# Altium schematic sheet 12_Clock_2.SchDoc: Clock 2
size A3; Organization: Lime Microsystems; Address1: Surrey Tech Centre; Address2: Guildford GU2 7YG; Address3: Surrey; Address4: United Kingdom; SheetNumber: 12
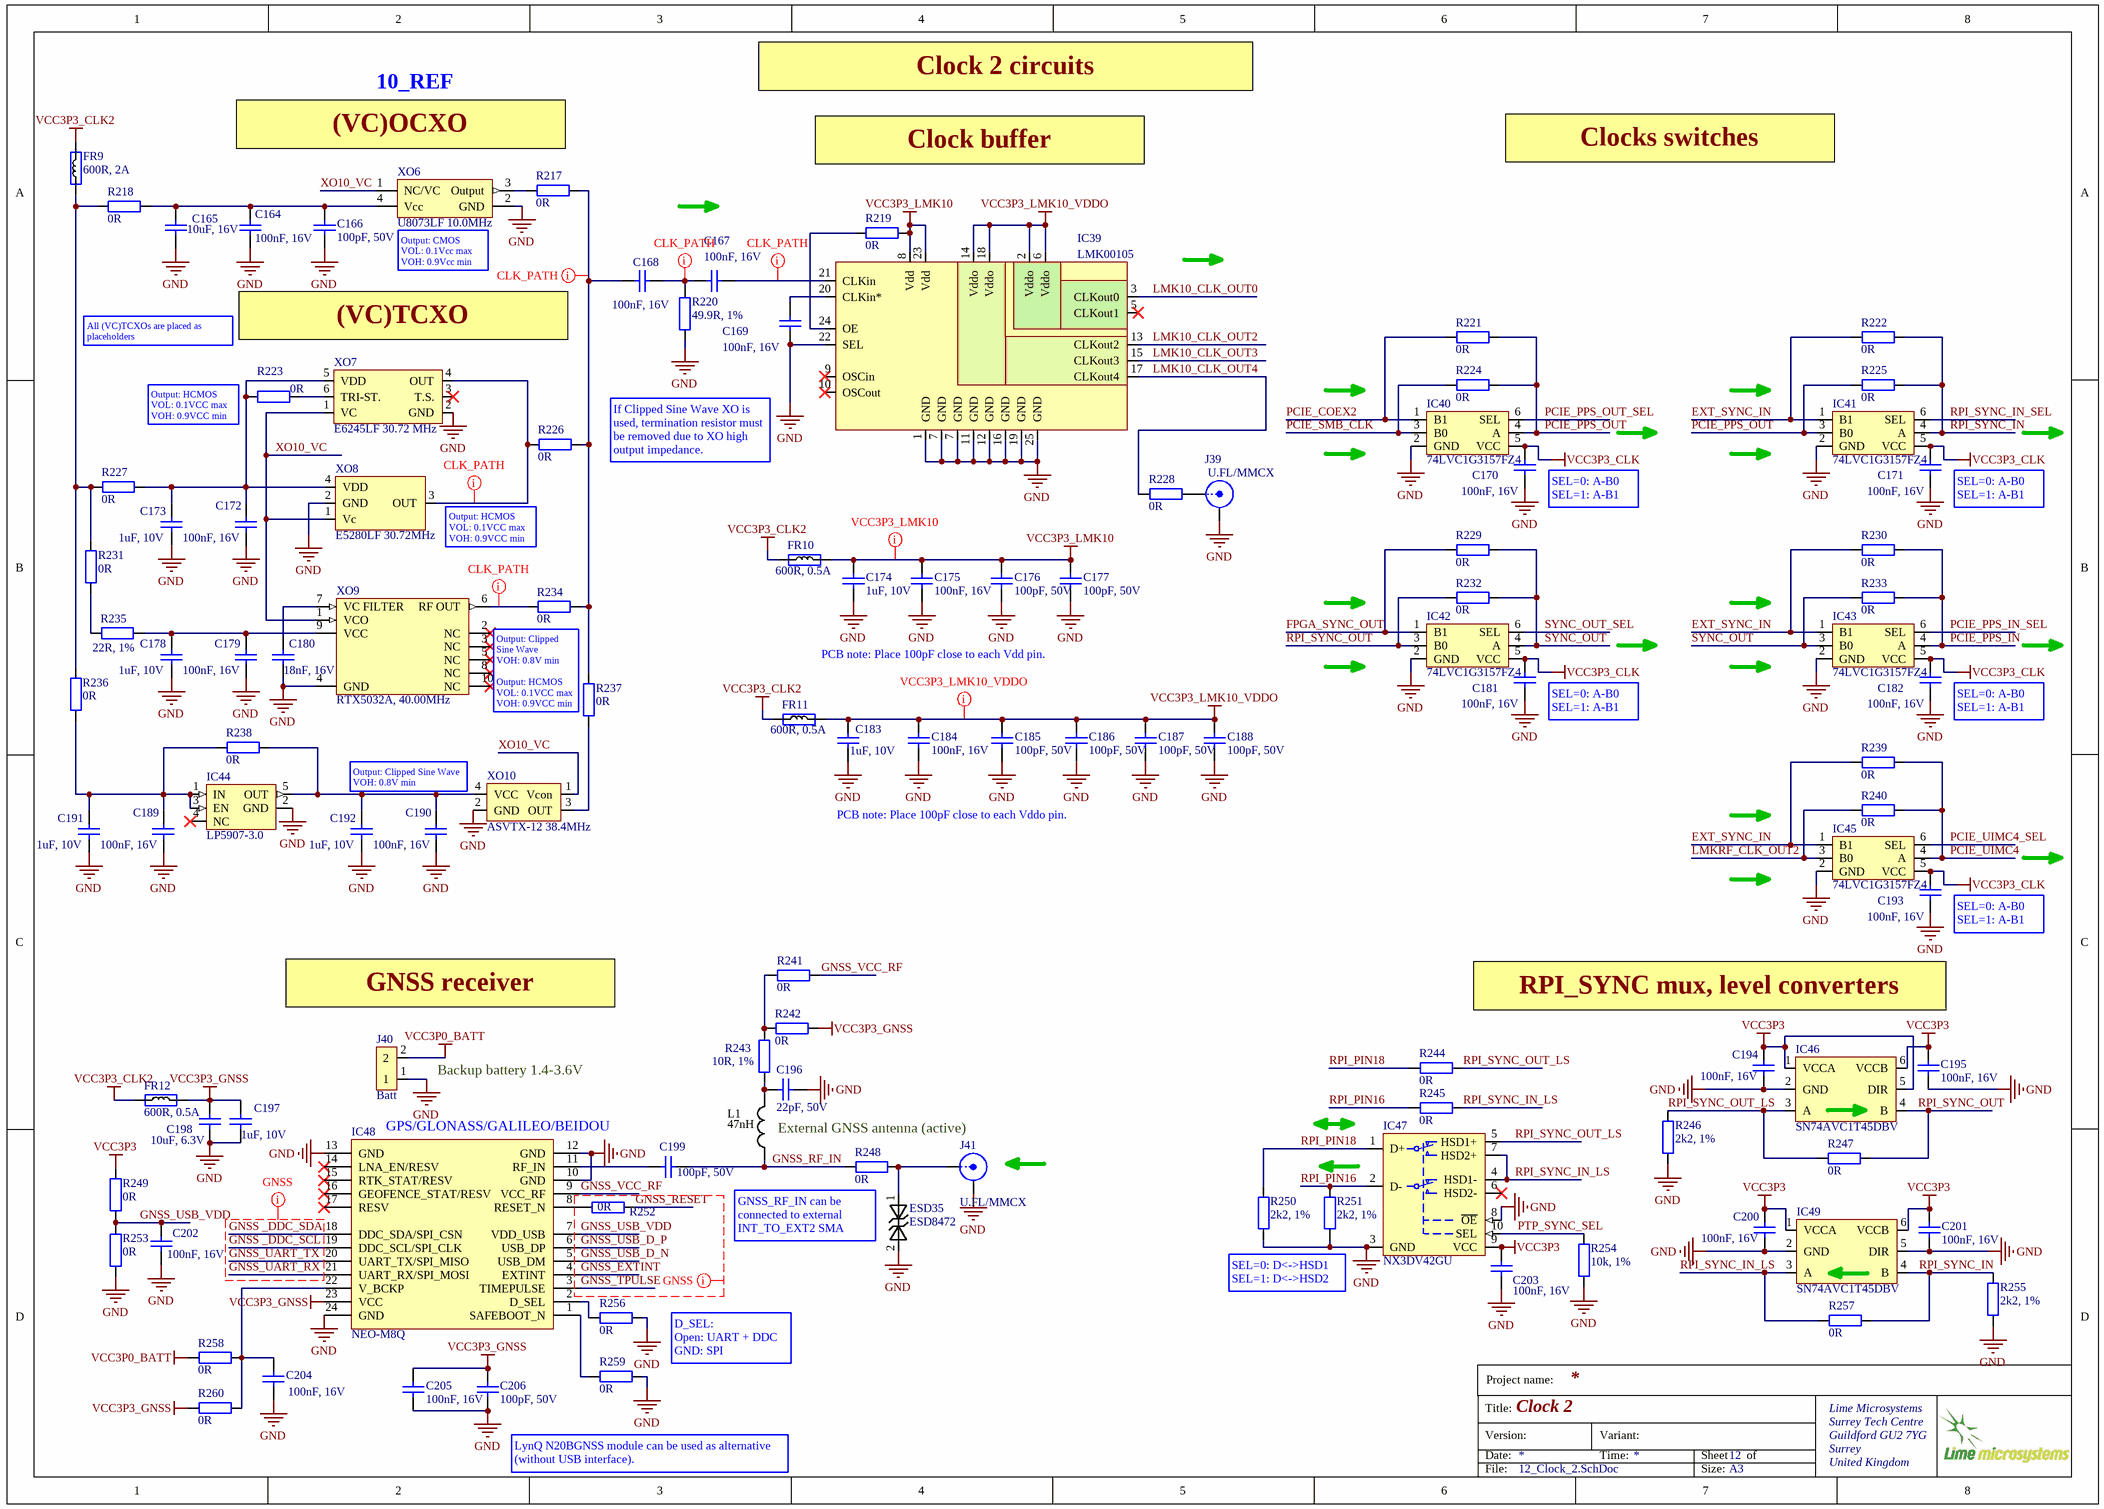
[diagram p0: 12_Clock_2.SchDoc]

## Parts
C164  100nF, 16V  [CAP0402]
C165  10uF, 16V  [CAP0603]
C166  100pF, 50V  [CAP0402]
C167  100nF, 16V  [CAP0402]
C168  100nF, 16V  [CAP0402]
C169  100nF, 16V  [CAP0402]
C170  100nF, 16V  [CAP0402]
C171  100nF, 16V  [CAP0402]
C172  100nF, 16V  [CAP0402]
C173  1uF, 10V  [CAP0402]
C174  1uF, 10V  [CAP0402]
C175  100nF, 16V  [CAP0402]
C176  100pF, 50V  [CAP0402]
C177  100pF, 50V  [CAP0402]
C178  1uF, 10V  [CAP0402]
C179  100nF, 16V  [CAP0402]
C180  18nF, 16V  [CAP0402]
C181  100nF, 16V  [CAP0402]
C182  100nF, 16V  [CAP0402]
C183  1uF, 10V  [CAP0402]
C184  100nF, 16V  [CAP0402]
C185  100pF, 50V  [CAP0402]
C186  100pF, 50V  [CAP0402]
C187  100pF, 50V  [CAP0402]
C188  100pF, 50V  [CAP0402]
C189  100nF, 16V  [CAP0402]
C190  100nF, 16V  [CAP0402]
C191  1uF, 10V  [CAP0402]
C192  1uF, 10V  [CAP0402]
C193  100nF, 16V  [CAP0402]
C194  100nF, 16V  [CAP0402]
C195  100nF, 16V  [CAP0402]
C196  22pF, 50V  [CAP0402]
C197  1uF, 10V  [CAP0402]
C198  10uF, 6.3V  [CAP0603]
C199  100pF, 50V  [CAP0402]
C200  100nF, 16V  [CAP0402]
C201  100nF, 16V  [CAP0402]
C202  100nF, 16V  [CAP0402]
C203  100nF, 16V  [CAP0402]
C204  100nF, 16V  [CAP0402]
C205  100nF, 16V  [CAP0402]
C206  100pF, 50V  [CAP0402]
ESD35  ESD8472  [ESD8472_X3DFN2]
FR9  600R, 2A  [RES0805]
FR10  600R, 0.5A  [RES0402]
FR11  600R, 0.5A  [RES0402]
FR12  600R, 0.5A  [RES0402]
IC39  LMK00105  [LMK00105SQ]
IC40  74LVC1G3157FZ4  [74LVC1G3157FZ4_SPDT_SW_DFN1410-6]
IC41  74LVC1G3157FZ4  [74LVC1G3157FZ4_SPDT_SW_DFN1410-6]
IC42  74LVC1G3157FZ4  [74LVC1G3157FZ4_SPDT_SW_DFN1410-6]
IC43  74LVC1G3157FZ4  [74LVC1G3157FZ4_SPDT_SW_DFN1410-6]
IC44  LP5907-3.0  [SOT23-5]
IC45  74LVC1G3157FZ4  [74LVC1G3157FZ4_SPDT_SW_DFN1410-6]
IC46  SN74AVC1T45DBV  [SOT23-6]
IC47  NX3DV42GU  [FSUSB42UMX]
IC48  NEO-M8Q  [NEO-7M/8M]
IC49  SN74AVC1T45DBV  [SOT23-6]
J39  U.FL/MMCX  [MMCX_UFL_conn_u]
J40  Batt  [HDR_1x2]
J41  U.FL/MMCX  [MMCX_UFL_conn_u]
L1  47nH  [RES0402]
R217  0R  [RES0402_v2]
R218  0R  [RES0402]
R219  0R  [RES0402]
R220  49.9R, 1%  [RES0402]
R221  0R  [RES0402_v2]
R222  0R  [RES0402_v2]
R223  0R  [RES0402]
R224  0R  [RES0402_v2]
R225  0R  [RES0402_v2]
R226  0R  [RES0402_v2]
R227  0R  [RES0402]
R228  0R  [RES0402]
R229  0R  [RES0402_v2]
R230  0R  [RES0402_v2]
R231  0R  [RES0402]
R232  0R  [RES0402_v2]
R233  0R  [RES0402_v2]
R234  0R  [RES0402_v2]
R235  22R, 1%  [RES0402]
R236  0R  [RES0402]
R237  0R  [RES0402_v2]
R238  0R  [RES0402]
R239  0R  [RES0402_v2]
R240  0R  [RES0402_v2]
R241  0R  [RES0402]
R242  0R  [RES0402]
R243  10R, 1%  [RES0402]
R244  0R  [RES0402]
R245  0R  [RES0402]
R246  2k2, 1%  [RES0402]
R247  0R  [RES0402]
R248  0R  [RES0402_v2]
R249  0R  [RES0402]
R250  2k2, 1%  [RES0402]
R251  2k2, 1%  [RES0402]
R252  0R  [RES0402]
R253  0R  [RES0402]
R254  10k, 1%  [RES0402]
R255  2k2, 1%  [RES0402]
R256  0R  [RES0402]
R257  0R  [RES0402]
R258  0R  [RES0402]
R259  0R  [RES0402]
R260  0R  [RES0402]
XO6  U8073LF 10.0MHz  [AOCJYR-10.000MHz]
XO7  E6245LF 30.72 MHz  [RAKON_RPT7050A]
XO8  E5280LF 30.72MHz  [RAKON_TXCO]
XO9  RTX5032A, 40.00MHz  [RAKON_RTX5032A]
XO10  ASVTX-12 38.4MHz  [CRYSTAL_4-LCC_2P5x2P0]

## Nets
GND: C164.1 C165.1 C166.2 C169.1 C170.1 C171.1 C172.1 C173.1 C174.1 C175.1 C176.1 C177.1 C178.1 C179.1 C180.1 C181.1 C182.1 C183.1 C184.1 C185.1 C186.1 C187.1 C188.1 C189.1 C190.1 C191.1 C192.1 C193.1 C194.2 C195.2 C196.1 C197.1 C198.1 C200.2 C201.2 C202.2 C203.2 C204.2 C205.1 C206.2 ESD35.2 IC39.1(GND) IC39.7(GND) IC39.11(GND) IC39.12(GND) IC39.16(GND) IC39.19(GND) IC39.22(SEL) IC39.25(GND) IC40.2(GND) IC41.2(GND) IC42.2(GND) IC43.2(GND) IC44.2(GND) IC45.2(GND) IC46.2(GND) IC47.3(GND) IC47.8(~{OE}) IC48.10(GND) IC48.12(GND) IC48.13(GND) IC48.24(GND) IC49.2(GND) IC49.5(DIR) J39.2(Y) J40.1 J41.2(Y) R220.1 R246.2 R250.2 R251.2 R253.1 R254.2 R255.2 R256.1 R259.1 XO6.2(GND) XO7.2(GND) XO8.2(GND) XO9.4(GND) XO10.2(GND)
VCC3P0_BATT: J40.2 R258.2
VCC3P3: C194.1 C195.1 C200.1 C201.1 C203.1 IC46.1(VCCA) IC46.5(DIR) IC46.6(VCCB) IC47.9(VCC) IC49.1(VCCA) IC49.6(VCCB) R249.1
VCC3P3_CLK: C170.2 C171.2 C181.2 C182.2 C193.2 IC40.5(VCC) IC41.5(VCC) IC42.5(VCC) IC43.5(VCC) IC45.5(VCC)
VCC3P3_CLK2: FR9.1 FR10.1 FR11.1 FR12.1
VCC3P3_GNSS: C197.2 C198.2 C205.2 C206.1 FR12.2 IC48.23(VCC) R242.1 R260.2
VCC3P3_LMK10: C174.2 C175.2 C176.2 C177.2 FR10.2 IC39.8(Vdd) IC39.23(Vdd) R219.2
VCC3P3_LMK10_VDDO: C183.2 C184.2 C185.2 C186.2 C187.2 C188.2 FR11.2 IC39.2(Vddo) IC39.6(Vddo) IC39.14(Vddo) IC39.18(Vddo)
EXT_SYNC_IN: IC41.1(B1) IC43.1(B1) IC45.1(B1) R222.2 R230.2 R239.2
FPGA_SYNC_OUT: IC42.1(B1) R229.2
GNSS _DDC_SCL: IC48.19(DDC_SCL/SPI_CLK)
GNSS _DDC_SDA: IC48.18(DDC_SDA/SPI_CSN)
GNSS_EXTINT: IC48.4(EXTINT)
GNSS_RESET: R252.1
GNSS_RF_IN: C199.1 L1.1 R248.2
GNSS_TPULSE: IC48.3(TIMEPULSE)
GNSS_UART_RX: IC48.21(UART_RX/SPI_MOSI)
GNSS_UART_TX: IC48.20(UART_TX/SPI_MISO)
GNSS_USB_D_N: IC48.5(USB_DM)
GNSS_USB_D_P: IC48.6(USB_DP)
GNSS_USB_VDD: C202.1 IC48.7(VDD_USB) R249.2 R253.2
GNSS_VCC_RF: IC48.9(VCC_RF) R241.2
LMK10_CLK_OUT0: IC39.3(CLKout0)
LMK10_CLK_OUT2: IC39.13(CLKout2)
LMK10_CLK_OUT3: IC39.15(CLKout3)
LMK10_CLK_OUT4: IC39.17(CLKout4) R228.2
LMKRF_CLK_OUT2: IC45.3(B0) R240.2
PCIE_COEX2: IC40.1(B1) R221.2
PCIE_PPS_IN: IC43.4(A) R230.1 R233.1
PCIE_PPS_IN_SEL: IC43.6(SEL)
PCIE_PPS_OUT: IC40.4(A) IC41.3(B0) R221.1 R224.1 R225.2
PCIE_PPS_OUT_SEL: IC40.6(SEL)
PCIE_SMB_CLK: IC40.3(B0) R224.2
PCIE_UIMC4: IC45.4(A) R239.1 R240.1
PCIE_UIMC4_SEL: IC45.6(SEL)
PTP_SYNC_SEL: IC47.10(SEL) R254.1
RPI_PIN16: IC47.2(D-) R245.2 R251.1
RPI_PIN18: IC47.1(D+) R244.2 R250.1
RPI_SYNC_IN: IC41.4(A) IC49.4(B) R222.1 R225.1 R255.1 R257.1
RPI_SYNC_IN_LS: IC47.4(HSD1-) IC47.7(HSD2+) IC49.3(A) R245.1 R257.2
RPI_SYNC_IN_SEL: IC41.6(SEL)
RPI_SYNC_OUT: IC42.3(B0) IC46.4(B) R232.2 R247.1
RPI_SYNC_OUT_LS: IC46.3(A) IC47.5(HSD1+) R244.1 R246.1 R247.2
SYNC_OUT: IC42.4(A) IC43.3(B0) R229.1 R232.1 R233.2
SYNC_OUT_SEL: IC42.6(SEL)
XO10_VC: XO6.1(NC/VC) XO7.1(VC) XO8.1(Vc) XO9.1(VCO) XO10.1(Vcon)
NetC164_2: C164.2 C165.2 C166.1 R218.2 XO6.4(Vcc)
NetC167_1: C167.1 IC39.21(CLKin)
NetC167_2: C167.2 C168.1 R220.2
NetC168_2: C168.2 R217.1 R226.1 R234.2 R237.1
NetC169_2: C169.2 IC39.20(CLKin*)
NetC172_2: C172.2 C173.2 R223.2 R227.1 XO7.5(VDD) XO8.4(VDD)
NetC178_2: C178.2 C179.2 R235.2 XO9.9(VCC)
NetC180_2: C180.2 XO9.7(VC_FILTER)
NetC189_2: C189.2 C191.2 IC44.1(IN) IC44.3(EN) R236.2 R238.2
NetC190_2: C190.2 C192.2 IC44.5(OUT) R238.1 XO10.4(VCC)
NetC196_2: C196.2 L1.2 R243.1
NetC199_2: C199.2 IC48.11(RF_IN)
NetC204_1: C204.1 IC48.22(V_BCKP) R258.1 R260.1
NetESD35_1: ESD35.1 J41.1(X) R248.1
NetFR9_2: FR9.2 R218.1 R227.2 R231.1 R236.1
NetIC39_24: IC39.24(OE) R219.1
NetIC48_1: IC48.1(SAFEBOOT_N) R259.2
NetIC48_2: IC48.2(D_SEL) R256.2
NetIC48_8: IC48.8(RESET_N) R252.2
NetJ39_1: J39.1(X) R228.1
NetR217_2: R217.2 XO6.3(Output)
NetR223_1: R223.1 XO7.6(TRI-ST.)
NetR226_2: R226.2 XO7.4(OUT) XO8.3(OUT)
NetR231_2: R231.2 R235.1
NetR234_1: R234.1 XO9.6(RF_OUT)
NetR237_2: R237.2 XO10.3(OUT)
NetR241_1: R241.1 R242.2 R243.2

Not connected (* = marked no-connect by the designer): IC39 5(CLKout1)* 9(OSCin)* 10(OSCout)*; IC44 4(NC)*; IC47 6(HSD2-)*; IC48 14(LNA_EN/RESV)* 15(RTK_STAT/RESV)* 16(GEOFENCE_STAT/RESV)* 17(RESV)*; XO7 3(T.S.)*; XO9 2(NC)* 3(NC)* 5(NC)* 8(NC)* 10(NC)*

## Layout directives
net class CLK_PATH: NetC167_1, NetC167_2, NetC168_2, NetR226_2, NetR234_1
net class VCC3P3_LMK10: VCC3P3_LMK10
net class VCC3P3_LMK10_VDDO: VCC3P3_LMK10_VDDO
net class GNSS: GNSS _DDC_SCL, GNSS _DDC_SDA, GNSS_EXTINT, GNSS_RESET, GNSS_TPULSE, GNSS_UART_RX, GNSS_UART_TX, GNSS_USB_D_N, GNSS_USB_D_P, GNSS_USB_VDD

## Notes on the sheet
- 10_REF
- Clock 2 circuits
- (VC)OCXO
- Clock buffer
- Clocks switches
- (near XO6) Output: CMOS
  VOL: 0.1Vcc max
  VOH: 0.9Vcc min
- All (VC)TCXOs are placed as placeholders
- (VC)TCXO
- (near R223) Output: HCMOS
  VOL: 0.1VCC max
  VOH: 0.9VCC min
- (near R226) If Clipped Sine Wave XO is used, termination resistor must be removed due to XO high output impedance.
- (near C170) SEL=0: A-B0
  SEL=1: A-B1
- (near C171) SEL=0: A-B0
  SEL=1: A-B1
- (near XO8) Output: HCMOS
  VOL: 0.1VCC max
  VOH: 0.9VCC min
- (near R237) Output: Clipped Sine Wave
  VOH: 0.8V min
  Output: HCMOS
  VOL: 0.1VCC max
  VOH: 0.9VCC min
- PCB note: Place 100pF close to each Vdd pin.
- (near C181) SEL=0: A-B0
  SEL=1: A-B1
- (near C182) SEL=0: A-B0
  SEL=1: A-B1
- Output: Clipped Sine Wave
  VOH: 0.8V min
- PCB note: Place 100pF close to each Vddo pin.
- (near C193) SEL=0: A-B0
  SEL=1: A-B1
- (near J40) GNSS receiver
- RPI_SYNC mux, level converters
- (near J40) Backup battery 1.4-3.6V
- (near IC48) GPS/GLONASS/GALILEO/BEIDOU
- (near L1) External GNSS antenna (active)
- GNSS_RF_IN can be connected to external INT_TO_EXT2 SMA connector.
- SEL=0: D<->HSD1
  SEL=1: D<->HSD2
- D_SEL:
  Open: UART + DDC
  GND: SPI
- LynQ N20BGNSS module can be used as alternative  (without USB interface).
- Project name:
- Title:
- Version:
- Date:
- Variant:
- Time:
- Sheet
- of
- File:
- Size:
- A3

## Library data of the parts
C164 C167-C172 C175 C179 C181 C182 C184 C193-C195 C200 C201 C203 = Cap_0402: Manufacturer: Murata Electronics; Manufacturer Part Number: GRM155R71C104KA88D; Part Description: 0.10µF ±10% 16V Ceramic Capacitor X7R 0402 (1005 Metric); Tolerance: 10 %; Type: General Purpose MLCC; Capacitance: 0.1 uF; Case Length: 1 mm; Dielectric: X7R; Case Height: 0.5 mm; Temperature Coefficient / Code: +/- 15 %; Value: 100nF, 16V; Supplier 1: Mouser; Supplier Part Number 1: 81-GRM155R71C104KA88; Case Code - in: 0402; RoHS: RoHS Compliant; Operating Temperature Range: - 55 C to + 125 C; Series: GRM; Termination Style: SMD/SMT; Package / Case: 0402 (1005 metric); Voltage Rating DC: 16 V; Maximum Operating Temperature: + 125 C; Case Code - mm: 1005; Minimum Operating Temperature: - 55 C; Product Category: Low & Medium Capacitance SMD Ceramic Chip Capacitors; Packaging: Reel; Product: General Type MLCCs; Category: Multilayer Ceramic Capacitors MLCC - SMD/SMT; Brand: Murata Electronics; Case Width: 0.5 mm; RoHS - Mouser: Y; Standard Pack Qty: 10000; Minimum Order Quantity: 1; Reeling: True; Manufacturer Part Number 1: GRM155R71C104KA88D
C165 = Cap_0603: Manufacturer: Yageo; Manufacturer Part Number 1: GRM188R61C106MA73D; Part Description: 10µF ±20% 16V Ceramic Capacitor X5R 0603 (1608 Metric); Temperature Coefficient: X5R; Capacitance: 10µF; Tolerance: ±20%; Value: 10uF, 16V; Supplier 1: Digi-Key; Supplier Part Number 1: 490-7201-2-ND; Category: Capacitors; Ratings: -; Features: -; Lead Style: -; Package / Case: 0603 (1608 Metric); Lead Spacing: -; Applications: General Purpose; Voltage - Rated: 16V; Operating Temperature: -55°C ~ 85°C; Thickness (Max): 0.039" (1.00mm); Mounting Type: Surface Mount, MLCC; RoHS: RoHS Compliant; Size / Dimension: 0.063" L x 0.031" W (1.60mm x 0.80mm); Packaging: Tape & Reel (TR); Height - Seated (Max): -
C166 C199 C206 = Cap_0402: Manufacturer Part Number 1: CC0402JRNPO9BN101; Manufacturer: Yageo; Part Description: 100pF ±5% 50V C0G, NP0 Ceramic Capacitor -55°C ~ 125°C Surface Mount, MLCC 0402 (1005 Metric) 0.039" L x 0.020" W (1.00mm x 0.50mm); Tolerance: ±5%; Temperature Coefficient: C0G, NP0; Value: 100pF, 50V; Capacitance: 100pF; Thickness (Max): 0.022" (0.55mm); Size / Dimension: 0.039" L x 0.020" W (1.00mm x 0.50mm); RoHS: RoHS Compliant; Ratings: -; Package / Case: 0402 (1005 Metric); Mounting Type: Surface Mount, MLCC; Height - Seated (Max): -; Features: -; Lead Spacing: -; Voltage - Rated: 50V; Operating Temperature: -55°C ~ 125°C; Packaging: Cut Tape (CT); Applications: General Purpose; Lead Style: -; Supplier 1: Digi-Key; Category: Capacitors; Supplier Part Number 1: 311-1024-1-ND
C173 C178 = Cap_0402: CAP CER 1UF 10V X5R 0402; Manufacturer: Yageo; Part Description: 1µF 10V Ceramic Capacitor X5R 0402 (1005 Metric) 0.039" L x 0.020" W (1.00mm x 0.50mm); Manufacturer Part Number 1: CC0402MRX5R6BB105; Voltage Rating: 10; Capacitance: 1; Capacitance Tolerance: ± 10%; Ceramic Capacitor Case: 0402 [1005 Metric]; Dielectric Characteristic: X6; Product Range: TDK - C Series; Value: 1uF, 10V; Supplier 1: Digi-Key; Supplier Part Number 1: 311-1732-1-ND; RoHS: YES; MSL: -
C174 C183 C197 = Cap_0402: CAP CER 1UF 10V X5R 0402; Manufacturer: Yageo; Part Description: 1µF 10V Ceramic Capacitor X5R 0402 (1005 Metric) 0.039" L x 0.020" W (1.00mm x 0.50mm); Manufacturer Part Number 1: CC0402MRX5R6BB105; Notification: Current market demand for these product types have resulted in fluctuating and extending lead times. Lead times may differ.; Tolerance: ±20%; Value: 1uF, 10V; Supplier 1: Digi-Key; Supplier Part Number 1: 311-1732-1-ND; RoHS: RoHS Compliant; Applications: General Purpose; Category: Capacitors; ComponentLink1Description: http://www.yageo.com/documents/recent/UPY-GPHC_X5R_4V-to-50V_25.pdf; ComponentLink1URL: http://www.yageo.com/documents/recent/UPY-GPHC_X5R_4V-to-50V_25.pdf; Failure Rate: -; Features: -; Height - Seated (Max): -; Lead Spacing: -; Lead Style: -; Mounting Type: Surface Mount, MLCC; Operating Temperature: -55°C ~ 85°C; Package / Case: 0402 (1005 Metric); Packaging: Cut Tape (CT); Part Status: Active; Pricing 1: 1=0.22, 10=0.156, 100=0.0732, 500=0.0513, 1000=0.04248, 2500=0.03953, 5000=0.03617 (USD); Ratings: -; Size / Dimension: 0.039" L x 0.020" W (1.00mm x 0.50mm); Stock 1: 69600; Temperature Coefficient: X5R; Thickness (Max): 0.022" (0.55mm); Voltage - Rated: 10V
C176 C177 C185-C188 = Cap_0402: Manufacturer Part Number 1: CC0402JRNPO9BN101; Manufacturer: Yageo; Part Description: 100pF ±5% 50V C0G, NP0 Ceramic Capacitor -55°C ~ 125°C Surface Mount, MLCC 0402 (1005 Metric) 0.039" L x 0.020" W (1.00mm x 0.50mm); Temperature Coefficient: C0G, NP0; Tolerance: ±5%; Value: 100pF, 50V; Supplier 1: Digi-Key; Supplier Part Number 1: 311-1024-1-ND; RoHS: RoHS Compliant; Category: Capacitors; Applications: General Purpose; Mounting Type: Surface Mount, MLCC; Capacitance: 100pF; Ratings: -; Packaging: Cut Tape (CT); Voltage - Rated: 50V; Size / Dimension: 0.039" L x 0.020" W (1.00mm x 0.50mm); Height - Seated (Max): -; Package / Case: 0402 (1005 Metric); Operating Temperature: -55°C ~ 125°C; Features: -; Lead Spacing: -; Lead Style: -; Thickness (Max): 0.022" (0.55mm)
C180 = Cap_0402: Manufacturer: Yageo; Manufacturer Part Number 1: CC0402KRX7R7BB183; Part Description: 0.018µF ±10% 16V Ceramic Capacitor X7R 0402 (1005 Metric); Temperature Coefficient: X7R; Capacitance: 0.018µF; Tolerance: ±10%; Value: 18nF, 16V; Supplier 1: Digi-Key; Supplier Part Number 1: 311-1706-1-ND; Part Status: Active; Category: Capacitors; Packaging: Cut Tape (CT); Voltage - Rated: 16V; RoHS: RoHS Compliant; Size / Dimension: 0.039" L x 0.020" W (1.00mm x 0.50mm); Package / Case: 0402 (1005 Metric); Mounting Type: Surface Mount, MLCC; Thickness (Max): 0.022" (0.55mm); Applications: General Purpose; Operating Temperature: -55°C ~ 125°C
C189 C190 = Cap_0402: Manufacturer: Murata Electronics; Manufacturer Part Number 1: GRM155R71C104KA88D; Part Description: 0.10µF ±10% 16V Ceramic Capacitor X7R 0402 (1005 Metric); Tolerance: 10 %; Type: General Purpose MLCC; Capacitance: 0.1 uF; Case Length: 1 mm; Dielectric: X7R; Case Height: 0.5 mm; Temperature Coefficient / Code: +/- 15 %; Value: 100nF, 16V; Supplier 1: Mouser; Supplier Part Number 1: 81-GRM155R71C104KA88; Case Code - in: 0402; RoHS: RoHS Compliant; Operating Temperature Range: - 55 C to + 125 C; Series: GRM; Termination Style: SMD/SMT; Package / Case: 0402 (1005 metric); Voltage Rating DC: 16 V; Maximum Operating Temperature: + 125 C; Case Code - mm: 1005; Minimum Operating Temperature: - 55 C; Product Category: Low & Medium Capacitance SMD Ceramic Chip Capacitors; Packaging: Reel; Product: General Type MLCCs; Category: Multilayer Ceramic Capacitors MLCC - SMD/SMT; Brand: Murata Electronics; Case Width: 0.5 mm; RoHS - Mouser: Y; Standard Pack Qty: 10000; Minimum Order Quantity: 1; Reeling: True; Manufacturer Part Number: GRM155R71C104KA88D
C191 C192 = Cap_0402: Manufacturer Part Number 1: CC0402MRX5R6BB105; Manufacturer: Yageo; Part Description: 1µF 10V Ceramic Capacitor X5R 0402 (1005 Metric) 0.039" L x 0.020" W (1.00mm x 0.50mm); Voltage Rating: 10; Capacitance Tolerance: ± 10%; Product Range: TDK - C Series; Ceramic Capacitor Case: 0402 [1005 Metric]; Capacitance: 1; Dielectric Characteristic: X6; Value: 1uF, 10V; Supplier 1: Digi-Key; Supplier Part Number 1: 311-1732-1-ND; MSL: -; RoHS: YES
C196 = Cap_0402: Manufacturer: Yageo; Manufacturer Part Number 1: CC0402JRNPO9BN220; Part Description: 22pF ±5% 50V C0G, NP0 Ceramic Capacitor -55°C ~ 125°C Surface Mount, MLCC 0402 (1005 Metric) 0.039" L x 0.020" W (1.00mm x 0.50mm); Tolerance: ±5%; Temperature Coefficient: C0G, NP0; Value: 22pF, 50V; Supplier 1: Digi-Key; Supplier Part Number 1: 311-1018-2-ND; Category: Capacitors; Voltage - Rated: 50V; Packaging: Tape & Reel (TR); RoHS: RoHS Compliant; Capacitance: 22pF; Operating Temperature: -55°C ~ 125°C; Mounting Type: Surface Mount, MLCC; Height - Seated (Max): -; Size / Dimension: 0.039" L x 0.020" W (1.00mm x 0.50mm); Ratings: -; Applications: General Purpose; Thickness (Max): 0.022" (0.55mm); Lead Spacing: -; Lead Style: -; Features: -; Package / Case: 0402 (1005 Metric)
C198 = Cap_0603: Manufacturer Part Number 1: CC0603MRX5R5BB106; Manufacturer: Yageo; Part Description: 10µF ±20% 6.3V X5R Ceramic Capacitor -55°C ~ 85°C Surface Mount, MLCC 0603 (1608 Metric) 0.063" L x 0.031" W (1.60mm x 0.80mm); Capacitance: 10µF; Tolerance: ±20%; Supplier 1: Digi-Key; Supplier Part Number 1: 311-1448-2-ND; Package / Case: 0603 (1608 Metric); Category: Capacitors; Voltage - Rated: 6.3V; Value: 10uF, 6.3V
C202 C204 = Cap_0603: Manufacturer Part Number 1: GRM155R71C104KA88D; Part Description: 0.10µF ±10% 16V X7R Ceramic Capacitor -55°C ~ 125°C Surface Mount, MLCC 0402 (1005 Metric) 0.039" L x 0.020" W (1.00mm x 0.50mm); Brand: Murata Electronics; Tolerance: 10 %; Type: General Purpose MLCC; Capacitance: 0.1 uF; Temperature Coefficient / Code: +/- 15 %; Case Height: 0.5 mm; Case Length: 1 mm; Dielectric: X7R; Supplier 1: Mouser; Supplier Part Number 1: 81-GRM155R71C104KA88; Case Code - in: 0402; Manufacturer: Murata Electronics; Category: Multilayer Ceramic Capacitors MLCC - SMD/SMT; Voltage Rating DC: 16 V; Value: 100nF, 16V; Manufacturer Part Number: GRM155R71C104KA88D; Case Code - mm: 1005; Case Width: 0.5 mm; Maximum Operating Temperature: + 125 C; Minimum Operating Temperature: - 55 C; Minimum Order Quantity: 1; Operating Temperature Range: - 55 C to + 125 C; Package / Case: 0402 (1005 metric); Packaging: Reel; Product: General Type MLCCs; Product Category: Low & Medium Capacitance SMD Ceramic Chip Capacitors; Reeling: True; RoHS - Mouser: Y; RoHS: RoHS Compliant; Series: GRM; Standard Pack Qty: 10000; Termination Style: SMD/SMT
C205 = Cap_0402: Manufacturer: Murata Electronics; Manufacturer Part Number: GRM155R71C104KA88D; Part Description: 0.10µF ±10% 16V X7R Ceramic Capacitor -55°C ~ 125°C Surface Mount, MLCC 0402 (1005 Metric) 0.039" L x 0.020" W (1.00mm x 0.50mm); Tolerance: 10 %; Type: General Purpose MLCC; Capacitance: 0.1 uF; Case Length: 1 mm; Dielectric: X7R; Case Height: 0.5 mm; Temperature Coefficient / Code: +/- 15 %; Value: 100nF, 16V; Supplier 1: Mouser; Supplier Part Number 1: 81-GRM155R71C104KA88; Case Code - in: 0402; RoHS: RoHS Compliant; Operating Temperature Range: - 55 C to + 125 C; Series: GRM; Termination Style: SMD/SMT; Package / Case: 0402 (1005 metric); Voltage Rating DC: 16 V; Maximum Operating Temperature: + 125 C; Case Code - mm: 1005; Minimum Operating Temperature: - 55 C; Product Category: Low & Medium Capacitance SMD Ceramic Chip Capacitors; Packaging: Reel; Product: General Type MLCCs; Category: Multilayer Ceramic Capacitors MLCC - SMD/SMT; Brand: Murata Electronics; Case Width: 0.5 mm; RoHS - Mouser: Y; Standard Pack Qty: 10000; Minimum Order Quantity: 1; Reeling: True; Manufacturer Part Number 1: GRM155R71C104KA88D
ESD35 = ESD8472: Manufacturer: ON Semiconductor; Manufacturer Part Number: ESD8472MUT5G; Part Description: TVS DIODE 5.3VWM 14VC X3DFN2; Voltage - Reverse Standoff (Typ): 5.3V (Max); Voltage - Breakdown (Min): 7V; Voltage - Clamping (Max) @ Ipp: 14V; Current - Peak Pulse (10/1000µs): 3A (8/20µs); Power Line Protection: No; Capacitance @ Frequency: 0.2pF @ 1MHz; Supplier 1: Digi-Key; RoHS: RoHS Compliant; Category: Circuit Protection; Stock 1: 2295; Pricing 1: 1=0.39, 10=0.315, 100=0.2142, 500=0.16068, 1000=0.12051 (USD); Packaging: Cut Tape (CT); Part Status: Active; Type: Zener; Power - Peak Pulse: -; Applications: Automotive, RF Antenna; Operating Temperature: -55°C ~ 150°C (TJ); Mounting Type: Surface Mount; Package / Case: 2-XFDFN; Supplier Device Package: 2-X3DFN (0.62x0.32); ComponentLink1URL: http://www.onsemi.com/pub/Collateral/ESD8472-D.PDF; ComponentLink1Description: http://www.onsemi.com/pub/Collateral/ESD8472-D.PDF; Supplier Part Number 1: ESD8472MUT5GOSCT-ND; Manufacturer Part Number 1: ESD8472MUT5G
FR9 = Ferrite: Manufacturer Part Number 1: MPZ2012S601AT000; Manufacturer: TDK Corporation; Part Description: FERRITE BEAD 600 OHM 0805 1LN; DC Resistance (DCR): 100 mOhm Max; Filter Type: Differential Mode - Single; Impedance @ Frequency: 600 Ohm @ 100MHz; Supplier 1: Digi-Key; Supplier Part Number 1: 445-2206-2-ND; Value: 600R, 2A; Category: Filters; Current Rating: 2A; Height (Max): 0.041" (1.05mm); Mounting Type: Surface Mount; Package / Case: 0805 (2012 Metric); Packaging: Tape & Reel (TR); RoHS: RoHS Compliant; Size / Dimension: 0.079" L x 0.049" W (2.00mm x 1.25mm)
FR10-FR12 = Ferrite: Manufacturer: Murata; Manufacturer Part Number 1: BLM15AX601SN1D; Part Description: - Ferrite Bead 0402 (1005 Metric) 500mA 340mOhm; Tolerance: 25%; Current Rating: 500mA; Number of Lines: 1; DC Resistance (DCR): 340mR; Test Frequency: 100MHz; Value: 600R, 0.5A; Supplier 1: Digi-Key; Supplier Part Number 1: 490-5441-1-ND; Stock 1: 416370; Pricing 1: 1=0.1, 10=0.06, 25=0.0552, 50=0.0496, 100=0.0363, 250=0.0264, 500=0.0242, 1000=0.0209, 5000=0.0165 (USD); Case/Package: 0402; Number of Pins: 2; Case Code (Metric): 1005; Case Code (Imperial): 0402; Core Material: Ferrite; Material: Steel,Ferrite; Min Operating Temperature: -55°C; Max Operating Temperature: 125°C; Package Quantity: 1; Packaging: Tape and Reel; Series: BLM15AX_SN; Impedance: 600R; Max Current Rating: 500mA; Termination: SMD/SMT; Max DC Current: 500mA; Number of Circuits: 1; DC Resistance-Max: 340mR; Length: 1mm; Width: 0.5mm; Height: 0.5mm; Depth: 0.5mm; REACH SVHC: No SVHC; Lead Free: Lead Free; RoHS Compliant: Yes; ComponentLink1URL: https://www.murata.com/en-us/products/productdata/8796740059166/ENFA0018.pdf?src-supplier=Digi-Key; ComponentLink1Description: https://www.murata.com/en-us/products/productdata/8796740059166/ENFA0018.pdf?src-supplier=Digi-Key; ComponentLink2URL: http://search.murata.co.jp/Ceramy/image/img/PDF/ENG/L0110S0100BLM15AX_SN.pdf?src-supplier=Future+Electronics; ComponentLink2Description: http://search.murata.co.jp/Ceramy/image/img/PDF/ENG/L0110S0100BLM15AX_SN.pdf?src-supplier=Future+Electronics; ComponentLink3URL: http://www.produktinfo.conrad.com/datenblaetter/1100000-1199999/001171675-da-01-en-CHIP_DROSSEL0402_600R_420MA_1_0X0_5MM.pdf?src-supplier=Conrad; ComponentLink3Description: http://www.produktinfo.conrad.com/datenblaetter/1100000-1199999/001171675-da-01-en-CHIP_DROSSEL0402_600R_420MA_1_0X0_5MM.pdf?src-supplier=Conrad; ComponentLink4URL: http://www.produktinfo.conrad.com/datenblaetter/1100000-1199999/001172169-da-01-en-DROSSEL_0402_600R_1_0X0_5MM_10000ST.pdf?src-supplier=Conrad; ComponentLink4Description: http://www.produktinfo.conrad.com/datenblaetter/1100000-1199999/001172169-da-01-en-DROSSEL_0402_600R_1_0X0_5MM_10000ST.pdf?src-supplier=Conrad
IC39 = LMK00105: Manufacturer: Texas Instruments; Manufacturer Part Number 1: LMK00105SQ/NOPB; Part Description: IC CLK BUFFER 2:5 200MHZ 24WQFN; Frequency - Max: 200MHz; Voltage - Supply: 2.375 V ~ 3.45 V; Input: HCSL, LVCMOS, LVDS, LVPECL, LVTTL, SSTL, Crystal; Differential - Input:Output: Yes/No; Supplier 1: Digi-Key; Type: Fanout Buffer (Distribution), Multiplexer, Translator; Category: Integrated Circuits (ICs); Operating Temperature: -40°C ~ 85°C; Package / Case: 24-WFQFN Exposed Pad; Supplier Device Package: 24-WQFN (4x4); Supplier Part Number 1: LMK00105SQ/NOPBCT-ND
IC40-IC43 IC45 = 74LVC1G3157FZ4_SPDT_SW: Part Description: 1 Circuit IC Switch 2:1 10Ohm X2-DFN1410-6; Manufacturer: Diodes; Manufacturer Part Number 1: 74LVC1G3157FZ4-7; Number of Circuits: 1; On-State Resistance: 10R; -3db Bandwidth: 300MHz; Supplier 1: Digi-Key; Supplier Part Number 1: 74LVC1G3157FZ4-7DICT-ND; Stock 1: 158709; Pricing 1: 1=0,42000, 10=0,31200, 25=0,27320, 100=0,17670, 250=0,14628, 500=0,11702, 1000=0,08972, 2500=0,07802 (USD); RoHS: Yes; Number of Pins: 6; Min Operating Temperature: -40°C; Max Operating Temperature: 125°C; Packaging: Tape and Reel; RoHS Compliant: Yes; ComponentLink1URL: https://www.diodes.com/assets/Datasheets/74LVC1G3157.pdf?src-supplier=Digi-Key; ComponentLink1Description: https://www.diodes.com/assets/Datasheets/74LVC1G3157.pdf?src-supplier=Digi-Key; ComponentLink2URL: https://www.diodes.com/assets/product-showcases/74LVC3157-NPA-0516.pdf?src-supplier=Digi-Key; ComponentLink2Description: https://www.diodes.com/assets/product-showcases/74LVC3157-NPA-0516.pdf?src-supplier=Digi-Key
IC44 = LP5907: Manufacturer: Texas Instruments; Manufacturer Part Number 1: LP5907QMFX-3.0Q1; Part Description: Linear Voltage Regulator IC Positive Fixed 1 Output  250mA SOT-23-5; Number of Outputs: 1; Min Input Voltage: 2.2V; Max Input Voltage: 5.5V; Max Output Current: 250mA; Output Voltage: 3V; Dropout Voltage: 50mV; Polarity: Positive; Quiescent Current: 425uA; Accuracy: 2%; Output Type: Fixed; Supplier 1: Digi-Key; Stock 1: 90911; Pricing 1: 1 = 0,65000, 10 = 0,56000, 100 = 0,41820, 500 = 0,32858, 1000 = 0,25390 (USD); RoHS: Yes; Mount: Surface Mount; Case/Package: SOT-23-5; Min Operating Temperature: -40°C; Max Operating Temperature: 125°C; Packaging: Tape and Reel; Output Current: 250mA; Number of Regulators: 1; Radiation Hardening: No; Lead Free: Lead Free; ComponentLink1URL: https://datasheet.ciiva.com/48677/lp5907-q1-48677562.pdf?src-supplier=Avnet; ComponentLink1Description: https://datasheet.ciiva.com/48677/lp5907-q1-48677562.pdf?src-supplier=Avnet; Supplier Part Number 1: 296-40364-1-ND
IC46 IC49 = SN74AVC1T45DBV: Manufacturer: Texas Instruments; Manufacturer Part Number 1: SN74AXC1T45DBVR; Part Description: Voltage Level Translator Bidirectional 1 Circuit 1 Channel 500Mbps SOT-23-6; Number of Bits: 1; Channel Type: Bidirectional; Data Rate: 500Mbps; Supplier 1: Digi-Key; Supplier Part Number 1: 296-47598-1-ND; Stock 1: 116252; Pricing 1: 1=0,68000, 10=0,59800, 25=0,56200, 100=0,45860, 250=0,42596, 500=0,36252, 1000=0,29002 (USD); RoHS: Yes; Mount: Surface Mount; Case/Package: SOT-23-6; Min Operating Temperature: -40°C; Max Operating Temperature: 125°C; Packaging: Cut Tape; Number of Circuits: 1; RoHS Compliant: Yes; ComponentLink1URL: http://www.ti.com/lit/ds/symlink/sn74axc1t45.pdf?src-supplier=Digi-Key; ComponentLink1Description: http://www.ti.com/lit/ds/symlink/sn74axc1t45.pdf?src-supplier=Digi-Key; ComponentLink2URL: http://www.ti.com/general/docs/suppproductinfo.tsp?distId=10&amp;gotoUrl=http%3A%2F%2Fwww.ti.com%2Flit%2Fgpn%2Fsn74axc1t45&src-supplier=Digi-Key; ComponentLink2Description: http://www.ti.com/general/docs/suppproductinfo.tsp?distId=10&amp;gotoUrl=http%3A%2F%2Fwww.ti.com%2Flit%2Fgpn%2Fsn74axc1t45&src-supplier=Digi-Key
IC47 = FSUSB42UMX: Part Description: USB Switch IC 1 Channel 10-UMLP (1.8x1.4); Manufacturer: NXP Semiconductors; Manufacturer Part Number 1: NX3DV42GU,115; ComponentLink1URL: https://www.fairchildsemi.com/datasheets/FS/FSUSB42.pdf; ComponentLink1Description: https://www.fairchildsemi.com/datasheets/FS/FSUSB42.pdf; Supplier 1: Digikey; Supplier Part Number 1: 568-12388-1-ND; Stock 1: 3109; Pricing 1: 1=0,89, 10=0,781, 25=0,7336, 100=0,5987, 250=0,55612, 500=0,47328, 1000=0,37863 (USD); RoHS: Yes; ComponentLink2URL: http://www.mouser.com/ds/2/302/NX3DV42-1127466.pdf?src-supplier=Mouser; ComponentLink2Description: http://www.mouser.com/ds/2/302/NX3DV42-1127466.pdf?src-supplier=Mouser; ComponentLink3URL: http://www.nxp.com/documents/data_sheet/NX3DV42.pdf?src-supplier=Avnet; ComponentLink3Description: http://www.nxp.com/documents/data_sheet/NX3DV42.pdf?src-supplier=Avnet; ComponentLink4URL: http://www.nxp.com/documents/data_sheet/NX3DV42.pdf?src-supplier=Digikey; ComponentLink4Description: http://www.nxp.com/documents/data_sheet/NX3DV42.pdf?src-supplier=Digikey; ComponentLink5URL: https://www.nxp.com/docs/en/data-sheet/NX3DV42.pdf?src-supplier=Digikey; ComponentLink5Description: https://www.nxp.com/docs/en/data-sheet/NX3DV42.pdf?src-supplier=Digikey
IC48 = NEO-M8P_M8M: GNSS engine for GPS/QZSS, GLONASS; Manufacturer: U-blox; Manufacturer Part Number 1: NEO-M8Q-0; Part Description: IC RECEIVER GPS/GNSS 24LCC; Frequency: 1.575GHz; Sensitivity: -167dBm; Modulation or Protocol: BeiDou, Galileo, GLONASS, GNSS, GPS; Current - Receiving: 21mA; Data Interface: I2C, SPI, UART, USB; Voltage - Supply: 1.65 V ~ 3.6 V; DatasheetVersion: R07 11-Nov-2014; PackageDescription: NEO-7 series 12.2 x 16 x 2.4 mm; ComponentLink1URL: https://www.u-blox.com/en/product/neo-7-series; ComponentLink2Description: Datasheet; ComponentLink1Description: https://www.u-blox.com/en/product/neo-7-series; Supplier 1: Digi-Key; Supplier Part Number 1: 672-1009-1-ND; RoHS: RoHS Compliant; Category: RF/IF and RFID; Stock 1: 444; Pricing 1: 1=30.59, 10=26.65, 50=17.3, 100=13.169 (USD); Packaging: Cut Tape (CT); Part Status: Active; Data Rate (Max): -; Applications: General Purpose; Memory Size: -; Antenna Connector: -; Features: -; Operating Temperature: -40°C ~ 85°C; Package / Case: 24-SMD Module; Supplier Device Package: -; ComponentLink3URL: https://www.u-blox.com/sites/default/files/NEO-M8-FW3_DataSheet_(UBX-15031086).pdf; ComponentLink3Description: https://www.u-blox.com/sites/default/files/NEO-M8-FW3_DataSheet_(UBX-15031086).pdf
J39 J41 = RF_IF_connector: CONN UMC RCPT STR 50 OHM SMD; Manufacturer: Molex, LLC; Manufacturer Part Number 1: 0734120110; Body Finish: Nickel; Body Material: Phosphor Bronze; Center Contact Material: Brass; Center Contact Plating: Gold; Connector Style: Ultra Miniature Coaxial; Connector Type: Jack, Male Pin; Contact Termination: Solder; Dielectric Material: Liquid Crystal Polymer (LCP); Frequency - Max: 6GHz; Impedance: 50 Ohm; Voltage Rating: 60V; Cable Group: -; Category: Connectors, Interconnects; Fastening Type: Snap-On; Features: -; Housing Color: Silver; Ingress Protection: -; Mounting Type: Surface Mount; Operating Temperature: -40°C ~ 90°C; Packaging: Cut Tape (CT); RoHS: RoHS Compliant; Shield Termination: Solder; Supplier 1: Digi-Key; Supplier Part Number 1: WM5587CT-ND; Part Description: CONN UMC RCPT STR 50 OHM SMD
J40 = Jumper: Manufacturer Part Number 1: 961102-6404-AR; Part Description: 2 Positions Header, Unshrouded Connector 0.100" (2.54mm) Through Hole Gold; Manufacturer: 3M; Connector Type: Header, Unshrouded; Supplier 1: Digi-Key; Supplier Part Number 1: 3M9447-ND; Contact Type: Male Pin; Color: Black; Mounting Type: Through Hole; Category: Connectors, Interconnects; Contact Finish: Gold
L1 = Inductor_0603: Manufacturer: COILCRAFT; Manufacturer Part Number: 0402HP-47NXJLU; Part Description: INDUCTOR, RF, 47NH, 5%, 2.4GHZ, SMD; Product Range:0402HP Series; Inductance:47nH; Inductance Tolerance:± 5%; High Frequency Inductor Case:0402 [1005 Metric]; Self Resonant Frequency Min:2.4GHz; DC Resistance Max:0.58ohm; DC Current Rating:420mA; SVHC: No SVHC (15-Jun-2015); Inductance Tolerance: ± 5%; High Frequency Inductor Case: 0402 [1005 Metric]; Inductance: 47; DC Resistance Max: 0.58; Self Resonant Frequency Min: 2.4; Product Range: 0402; DC Current Rating: 420; Inductor Construction: Wirewound; Supplier 1: Farnell; Supplier Part Number 1: 2285856; Packaging: Cut Tape; Inductor Case Style: 0402 [1005 Metric]; RoHS: Y-EX; value: 47nH; Manufacturer Part Number 1: 0402HP-47NXJLU
R217-R219 R221-R234 R236-R242 R244 R245 R248 R249 R252 R253 R256 R258-R260 = Res_0402: Manufacturer Part Number 1: RC0402JR-070RL; Manufacturer: Yageo; Part Description: RES SMD 0.0OHM JUMPER 1/16W 0402; Resistance (Ohms): 0.0; Tolerance: Jumper; Power (Watts): 0.063W, 1/16W; Value: 0R; Supplier 1: Digi-Key; Supplier Part Number 1: 311-0.0JRTR-ND; Category: Resistors; Temperature Coefficient: -; Features: Moisture Resistant; Supplier Device Package: 0402; Height: 0.016" (0.40mm); Package / Case: 0402 (1005 Metric); Operating Temperature: -55°C ~ 155°C; Size / Dimension: 0.039" L x 0.020" W (1.00mm x 0.50mm); Composition: Thick Film; Packaging: Tape & Reel (TR); Number of Terminations: 2; RoHS: RoHS Compliant
R220 = Res_0402: Manufacturer: Samsung Electro-Mechanics America, Inc.; Part Description: RES SMD 49.9 OHM 1% 1/16W 0402; Manufacturer Part Number 1: RC1005F49R9CS; Temperature Coefficient: ±100ppm/°C; Resistance (Ohms): 49.9; Power (Watts): 0.063W, 1/16W; Number of Terminations: 2; Size / Dimension: 0.039" L x 0.020" W (1.00mm x 0.50mm); Supplier Device Package: 0402 (1005 Metric); RoHS: RoHS Compliant; Supplier Part Number 1: 1276-3469-6-ND; Features: -; Packaging: Digi-Reel®; Tolerance: ±1%; Height: 0.016" (0.40mm); Category: Resistors; Composition: Thick Film; Package / Case: 0402 (1005 Metric); Supplier 1: Digi-Key; Operating Temperature: -55°C ~ 155°C; Value: 49.9R, 1%
R235 = Res_0402: Part Description: RES SMD 22 OHM 1% 1/16W 0402; Manufacturer Part Number 1: RC0402FR-0722RL; Manufacturer: Yageo; Temperature Coefficient: ±100ppm/°C; Resistance (Ohms): 22; Supplier 1: Digi-Key; Supplier Part Number 1: 311-22.0LRTR-ND; Tolerance: ±1%; Supplier Device Package: 0402; Composition: Thick Film; Category: Resistors; Value: 22R, 1%
R243 = Res_0402: Manufacturer: Stackpole Electronics; Manufacturer Part Number 1: RMCF0402FT10R0; Part Description: 10 Ohms ±1% 0.063W, 1/16W Chip Resistor 0402 (1005 Metric) Automotive AEC-Q200 Thick Film; Power Rating: 63mW; Temperature Coefficient: 100ppm/°C; Value: 10R, 1%; Supplier 1: Digi-Key; Supplier Part Number 1: RMCF0402FT10R0CT-ND; Stock 1: 4909487; Pricing 1: 1=0,10000, 10=0,01400, 100=0,00560, 1000=0,00253, 2500=0,00220, 5000=0,00181 (USD); RoHS: Yes; Mount: Surface Mount; Case/Package: 0402; Case Code (Metric): 1005; Case Code (Imperial): 0402; Contact Plating: Tin,Matte; Size Code: 0402; Min Operating Temperature: -55°C; Max Operating Temperature: 155°C; Resistance: 10R; Tolerance: 1%; Packaging: Tape and Reel; Resistor Type: Thick Film; Number of Terminations: 2; Max Power Dissipation: 63mW; Features: Automotive AEC-Q200; Series: RMCF; Construction: Rectangular; Length: 0.039inch; Width: 0.02inch; Height: 0.016inch; Depth: 0.5mm; Radiation Hardening: No; Lead Free: Lead Free; Military Standard: Not; RoHS Compliant: Yes; ComponentLink1URL: http://components.arrow.com/part/dataview/44988361S6966751N1174?src-supplier=Arrow+Electronics; ComponentLink1Description: http://components.arrow.com/part/dataview/44988361S6966751N1174?src-supplier=Arrow+Electronics; ComponentLink2URL: https://www.seielect.com/catalog/SEI-RMCF_RMCP.pdf?src-supplier=Avnet; ComponentLink2Description: https://www.seielect.com/catalog/SEI-RMCF_RMCP.pdf?src-supplier=Avnet; ComponentLink3URL: https://www.seielect.com/catalog/SEI-Packaging.pdf?src-supplier=Digi-Key; ComponentLink3Description: https://www.seielect.com/catalog/SEI-Packaging.pdf?src-supplier=Digi-Key; ComponentLink4URL: http://www.seielect.com/Catalog/SEI-RMCF_RMCP.pdf?src-supplier=Future+Electronics; ComponentLink4Description: http://www.seielect.com/Catalog/SEI-RMCF_RMCP.pdf?src-supplier=Future+Electronics
R246 R250 R251 R255 = Res_0402: Manufacturer: Stackpole Electronics Inc; Manufacturer Part Number 1: RMCF0402FT2K20; Part Description: RES SMD 2.2K OHM 1% 1/16W 0402; Resistance (Ohms): 2.2k; Temperature Coefficient: ±100ppm/°C; Power (Watts): 0.063W, 1/16W; Value: 2k2, 1%; Supplier 1: Digi-Key; Supplier Part Number 1: RMCF0402FT2K20CT-ND; Supplier Device Package: 0402; Package / Case: 0402 (1005 Metric); Size / Dimension: 0.039" L x 0.020" W (1.00mm x 0.50mm); Operating Temperature: -55°C ~ 155°C; Composition: Thick Film; Category: Resistors; Features: -; Height: 0.016" (0.40mm); RoHS: RoHS Compliant; Number of Terminations: 2; Packaging: Cut Tape (CT); Tolerance: ±1%
R247 R257 = Res_0402: Manufacturer: Yageo; Part Description: RES SMD 0.0OHM JUMPER 1/16W 0402; Manufacturer Part Number 1: RC0402JR-070RL; Power (Watts): 0.063W, 1/16W; Resistance (Ohms): 0.0; Tolerance: Jumper; Supplier 1: Digi-Key; Supplier Part Number 1: 311-0.0JRTR-ND; Composition: Thick Film; Package / Case: 0402 (1005 Metric); Category: Resistors; Value: 0R; Features: Moisture Resistant; Height: 0.016" (0.40mm); Number of Terminations: 2; Operating Temperature: -55°C ~ 155°C; Packaging: Tape & Reel (TR); RoHS: RoHS Compliant; Size / Dimension: 0.039" L x 0.020" W (1.00mm x 0.50mm); Supplier Device Package: 0402; Temperature Coefficient: -
R254 = Res_0402: Manufacturer: Yageo; Manufacturer Part Number 1: RC0402FR-0710KL; Part Description: RES SMD 10K OHM 1% 1/16W 0402; Temperature Coefficient: ±100ppm/°C; Power (Watts): 0.063W, 1/16W; Value: 10k, 1%; Supplier 1: Digi-Key; Supplier Part Number 1: 311-10.0KLRTR-ND; Resistance (Ohms): 10k; Packaging: Tape & Reel (TR); RoHS: RoHS Compliant; Package / Case: 0402 (1005 Metric); Tolerance: ±1%; Operating Temperature: -55°C ~ 155°C; Size / Dimension: 0.039" L x 0.020" W (1.00mm x 0.50mm); Number of Terminations: 2; Category: Resistors; Height: 0.016" (0.40mm); Supplier Device Package: 0402; Features: Moisture Resistant; Composition: Thick Film
XO6 = AOCJYR-10.000MHz: Manufacturer: Rakon; Part Description: ROM9070PA 10.0MHz MERC+ 9x7 HOT CMOS 3.3V PULL; Oscillator Output Compatibility: CMOS; Oscillator Case: SMD, 9.7mm x 7.5; Supply Voltage Nom: 3.3; Frequency Nom, MHz: 10.0; Frequency Stability +/-, ppb: 20; Manufacturer Part Number 1: U8073LF; Supplier Part Number 1: U8073LF; Supplier 1: Rakon
XO7 = RPT7050A: Part Description: TCXO 30.72MHz, E6245LF; Manufacturer: Rakon; Manufacturer Part Number 1: E6245LF; Supplier 1: Rakon; Supplier Part Number 1: E6245LF
XO8 = TXCO: Part Description: TCXO 30.72MHz, E5280LF; Manufacturer: Rakon; Manufacturer Part Number 1: E5280LF; Supplier 1: Rakon; Supplier Part Number 1: E5280LF
XO9 = Rakon_RTX5032A: Part Description: RTX5032A 40MHz, High performance TCXO, With VC, Filter Enabled, 10-pin 5mm x 3.2 mm x 1.65 mm package; Manufacturer: Rakon; Manufacturer Part Number 1: RTX5032A; Supplier Part Number 1: RTX5032A; Supplier 1: RAKON
XO10 = ASVTX-12-A-38.400MHZ-H10-T_CRYSTAL: Oscillator Crystal; Manufacturer: Abracon; Part Description: 38.4MHz VCTCXO Clipped Sine Wave Oscillator 3V  4-SMD, No Lead; Operating Supply Voltage: 3V; Frequency Stability: 1ppm; Max Supply Current: 2.5mA; Supplier 1: Digi-Key; Manufacturer Part Number 1: ASVTX-12-A-38.400MHZ-H10-T; Stock 1: 1680; Pricing 1: 1 = 3,58000, 10 = 3,41000, 50 = 3,23960, 100 = 2,89850, 500 = 2,72800 (USD); RoHS: Yes; Mount: Surface Mount; Case/Package: SMD/SMT; Min Operating Temperature: -30°C; Max Operating Temperature: 85°C; Frequency: 38.4MHz; Package Quantity: 1000; Packaging: Tape and Reel; Termination: SMD/SMT; Length: 0.098inch; Height: 0.035inch; Width: 0.079inch; ComponentLink1URL: https://datasheet.ciiva.com/5466/astx12-asvtx12-8609-5466673.pdf?src-supplier=Mouser; ComponentLink1Description: https://datasheet.ciiva.com/5466/astx12-asvtx12-8609-5466673.pdf?src-supplier=Mouser; ComponentLink2URL: https://datasheet.ciiva.com/867/astx12-asvtx12-867453.pdf?src-supplier=Digi-Key; ComponentLink2Description: https://datasheet.ciiva.com/867/astx12-asvtx12-867453.pdf?src-supplier=Digi-Key; ComponentLink3URL: https://datasheet.ciiva.com/867/astx12-asvtx12-867454.pdf?src-supplier=Digi-Key; ComponentLink3Description: https://datasheet.ciiva.com/867/astx12-asvtx12-867454.pdf?src-supplier=Digi-Key; ComponentLink4URL: https://datasheet.ciiva.com/867/astx12-asvtx12-867455.pdf?src-supplier=Digi-Key; ComponentLink4Description: https://datasheet.ciiva.com/867/astx12-asvtx12-867455.pdf?src-supplier=Digi-Key; Supplier Part Number 1: 535-11790-1-ND